# EAGLE design T_LIDAR (EAGLE 9.4.2)
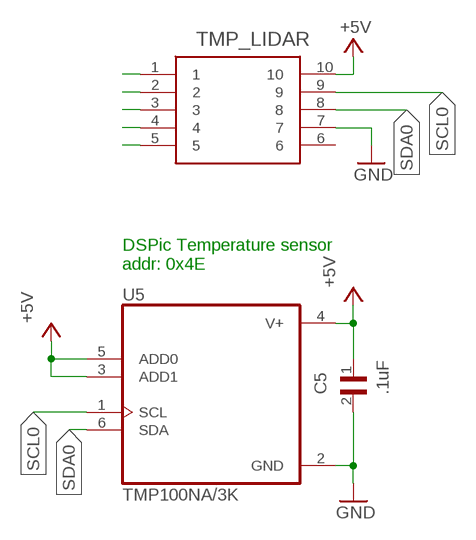
[diagram p0: schematic, sheet 1]

## Parts
C5  .1uF  08056C104JAZ2A  [CAPC2012X140N]
TMP_LIDAR  522071060  [522071060]
U5  TMP100NA/3K  [TMP100NA/3K]

## Nets
+5V [power]: C5.1 TMP_LIDAR.10 U5.3(ADD1) U5.4(V+) U5.5(ADD0)
GND: C5.2 TMP_LIDAR.7 U5.2(GND)
N$1: TMP_LIDAR.1
N$2: TMP_LIDAR.2
N$3: TMP_LIDAR.3
N$4: TMP_LIDAR.4
N$5: TMP_LIDAR.5
SCL0: TMP_LIDAR.9 U5.1(SCL)
SDA0: TMP_LIDAR.8 U5.6(SDA)
Unconnected: TMP_LIDAR.6

## Notes on the sheet
- DSPic Temperature sensor
  addr: 0x4E

## Library data of the parts
C5 = 08056C104JAZ2A:08056C104JAZ2A: Cap Ceramic 0.1uF 6.3V X7R 5% SMD 0805 FlexiTerm 125°C T/R; AVAILABILITY: Unavailable; DESCRIPTION: 0805 100 nF 6.3 V ±5 % Tolerance X7R SMT Multilayer Ceramic Capacitor; MF: AVX; MP: 08056C104JAZ2A; PACKAGE: 0805 AVX; PRICE: None
TMP_LIDAR = 522071060:522071060: SOCKET FPC, SMT, 1MM, 14 WAY; AVAILABILITY: Unavailable; DESCRIPTION: 1.00mm FFC/FPC Connectors HSG ASSY ZIF SMT 14P; MF: Molex; MP: 52207-1485; PACKAGE: None; PRICE: None
U5 = TMP100NA_3K:TMP100NA/3K: Digital Temperature Sensor with I2C Interface; AVAILABILITY: Unavailable; DESCRIPTION: Temperature Sensor with I2C/SMBus Interface in SOT-23 6-SOT-23 -55 to 125; MF: Texas Instruments; MP: TMP100NA/3K; PACKAGE: SOT-23 Texas Instruments; PRICE: None

## Net classes
1 power: width 0.254 mm

## Board
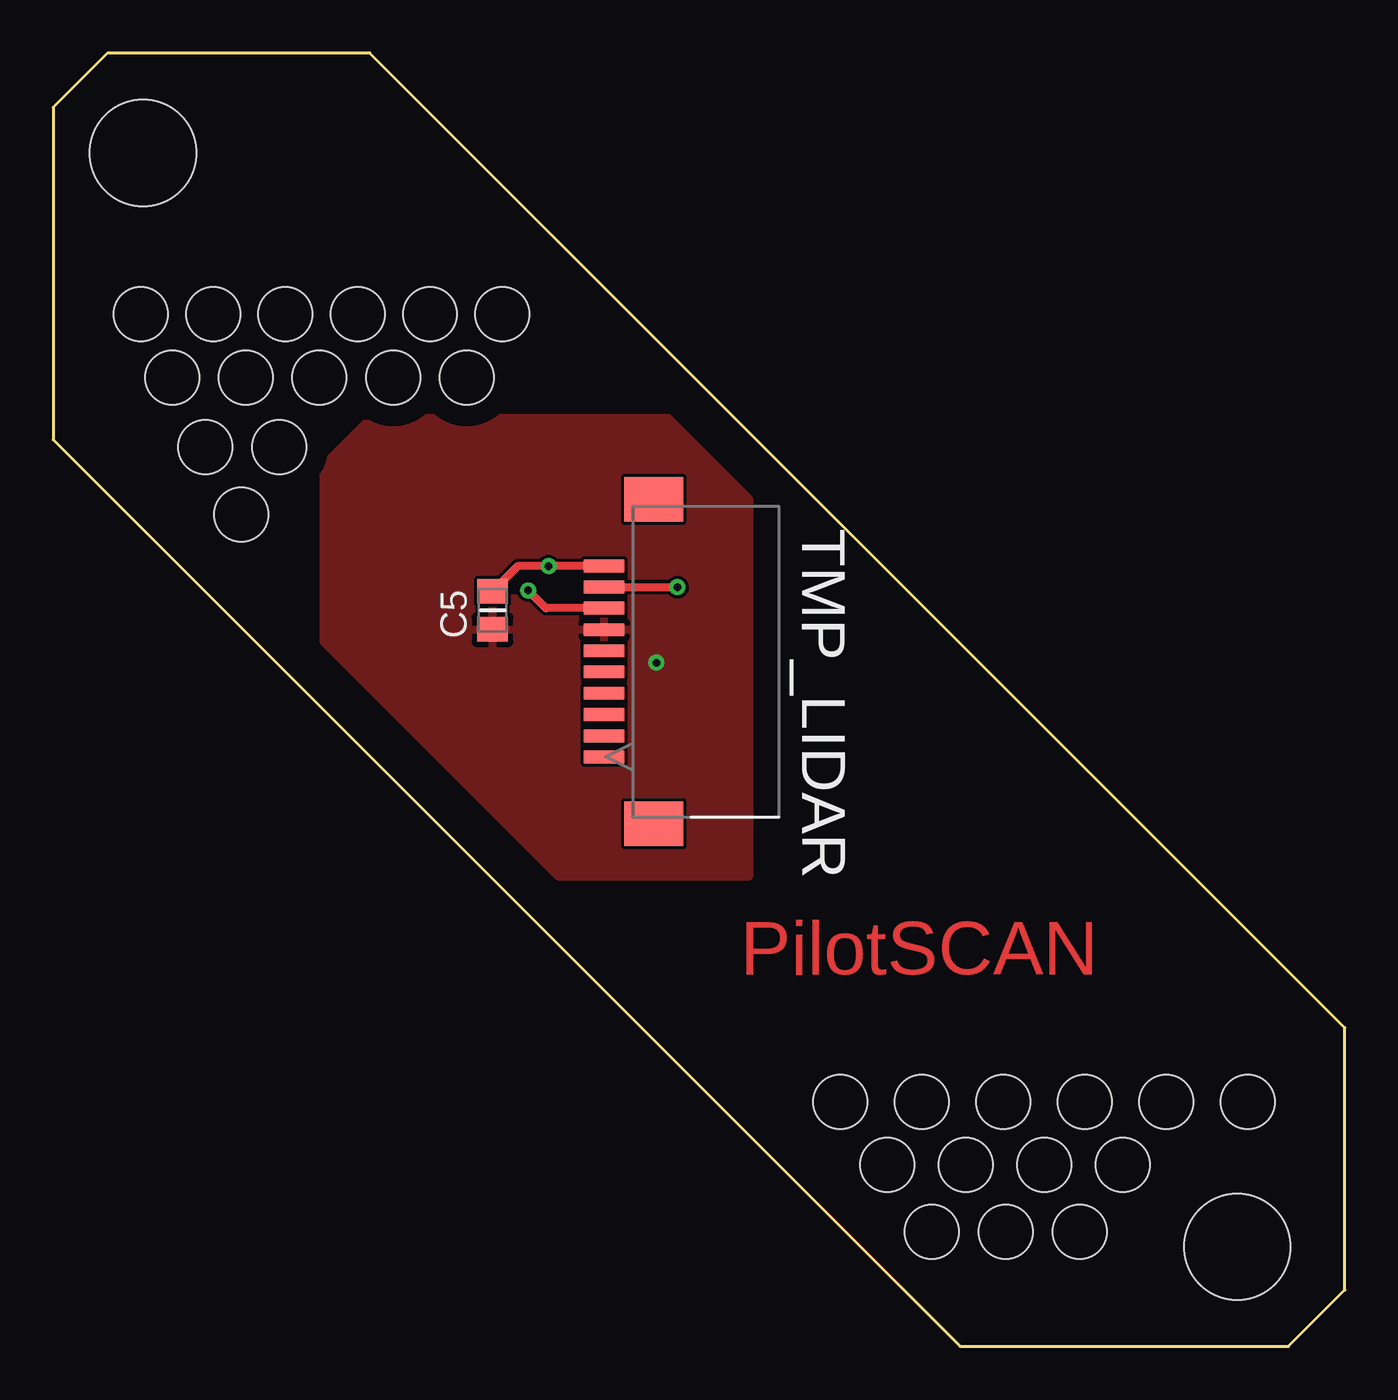
[diagram p1: board, top side]
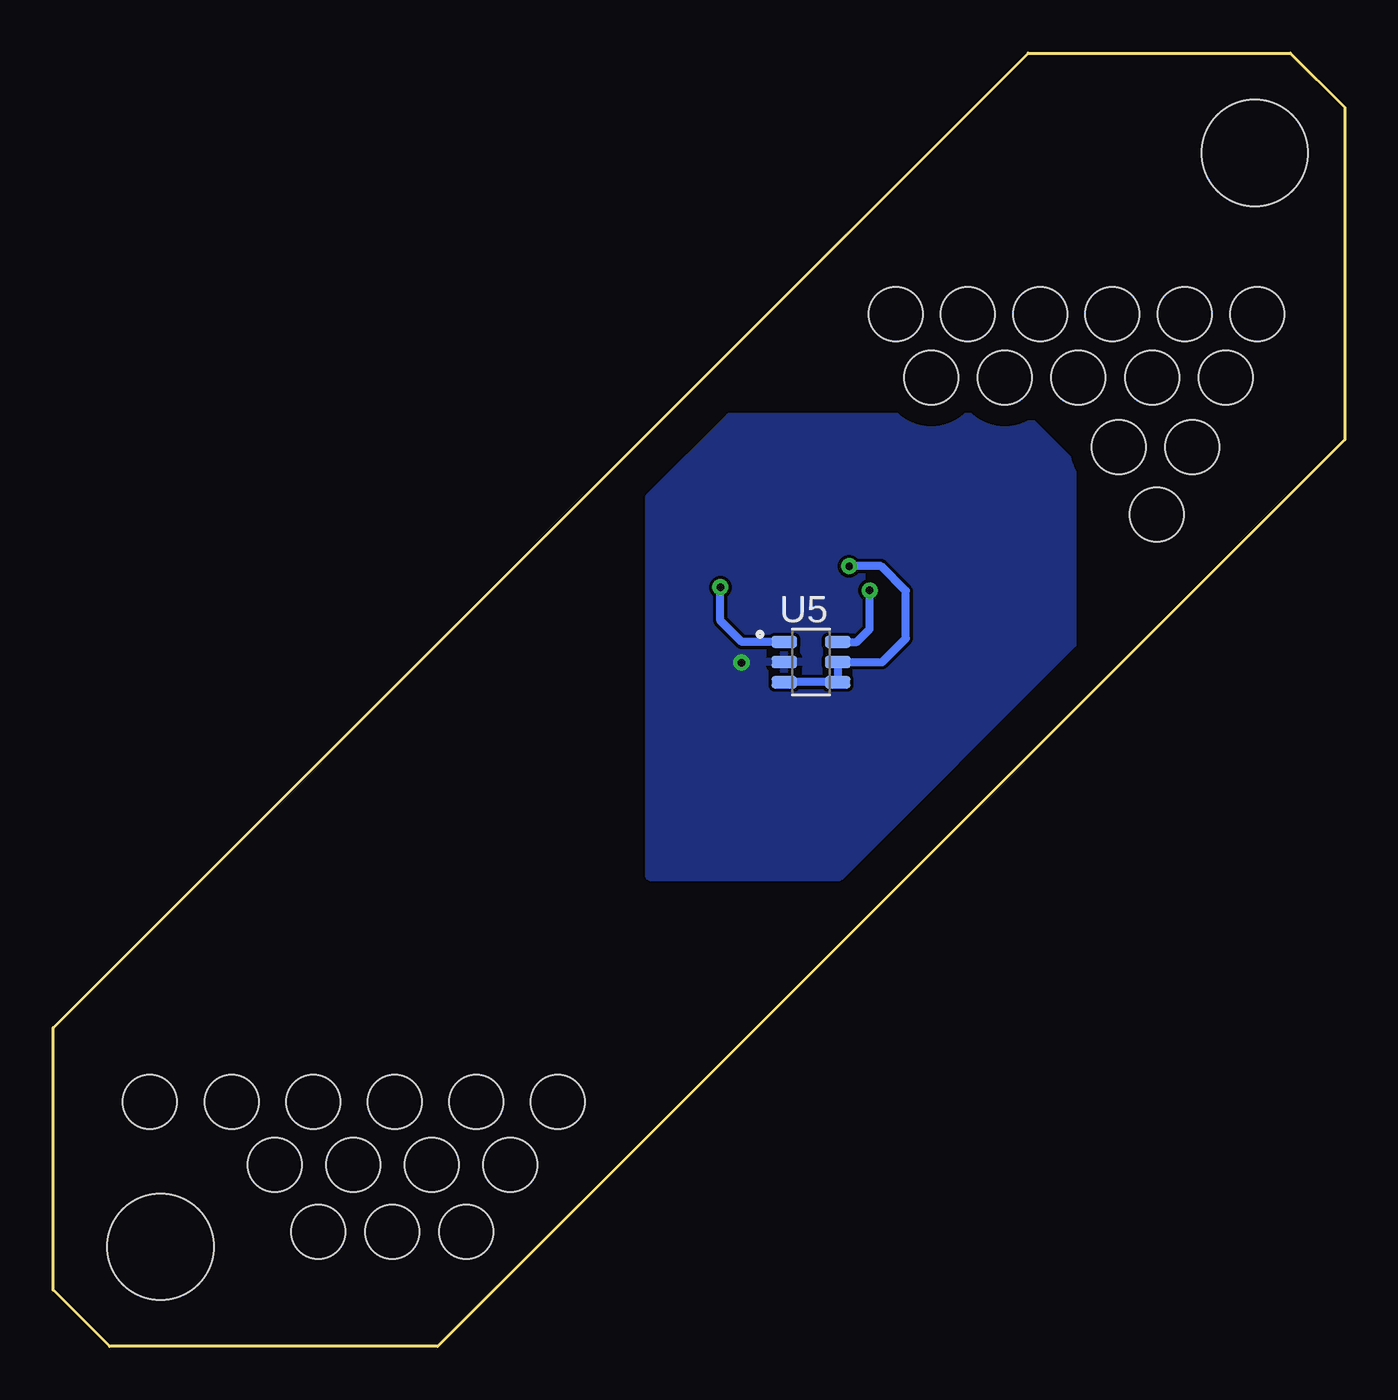
[diagram p2: board, bottom side, seen from below]

Size 60.91 x 61.01 mm. Coordinates in mm from the lower left corner, seen from the top.
Outline: 0,58.45 0,42.77 42.77,0 58.24,0 60.91,2.67 60.91,15.04 14.93,61.01 2.57,61.01 0,58.45
Copper layers (1*16): Top 0.035mm / dielectric 1.5mm / Bottom 0.035mm
Design rules "default": minimum track width 6mil, minimum drill 0.35mm, track to track 6mil, track to pad 6mil, pad to pad 6mil, via to via 6mil, smd to smd 6mil, copper to edge 40mil, drill to drill 6mil, minimum pad ring 10mil, minimum via ring 8mil, stop-mask expansion 4mil, vias tented up to drill 0mil, thermal gap 10mil
Holes 5 mm at 55.84,4.7 4.24,56.3
Holes 2.54 mm at 4.14,48.69 7.55,48.69 10.96,48.69 14.37,48.69 17.77,48.69 21.18,48.69 37.11,11.53 40.95,11.53 44.8,11.53 48.65,11.53 52.49,11.53 56.34,11.53 39.34,8.57 43.04,8.57 46.74,8.57 50.44,8.57 41.43,5.41 44.92,5.41 48.41,5.41 5.61,45.71 9.09,45.71 12.56,45.71 16.03,45.71 19.51,45.71 7.19,42.43 10.67,42.43 8.86,39.23

### Footprints (pad centres in the part's own frame; a part is rotated, then mirrored left to right if it is on the bottom)
CAPC2012X140N = smd 1.15 x 1.45: 1 -0.9,0; 2 0.9,0
522071060 = smd 0.61 x 1.905: 1 6.502,4.801; 2 5.512,4.801; 3 4.496,4.801; 4 3.505,4.801; 5 2.489,4.801; 6 1.499,4.801; 7 0.508,4.801; 8 -0.508,4.801; 9 -1.499,4.801; 10 -2.489,4.801 | smd 2.108 x 2.794: Z1 -5.642,7.137; Z2 9.652,7.137
TMP100NA/3K = smd 1.21 x 0.58: 1 -1.255,0.95; 2 -1.255,0; 3 -1.255,-0.95; 4 1.255,-0.95; 5 1.255,0; 6 1.255,0.95

### Placement (x,y rotation side)
C5  20.73,34.72 270 top
TMP_LIDAR  21.18,34.32 270 top
U5  25.17,32.28 0 bottom

### Tracks (layer width: path | path; a pad name or v marks a point on that pad's centre or on a via)
+5V  (via drill 0.35)
  Top 0.381: TMP_LIDAR.10 v23.37,36.8 21.91,36.8 C5.1
  Bottom 0.381: U5.3 U5.4 U5.5 21.82,32.28 20.7,33.4 20.7,35.64 21.87,36.8 v23.37,36.8
GND  (via drill 0.35)
  other vias: 28.45,32.26
  pour Top: 15.01,43.81 28.98,43.81 32.82,39.98 32.82,22.17 32.79,22.15 23.85,22.15 12.78,33.22 12.78,41.58
  pour Bottom: 15.01,43.84 29.01,43.84 32.82,40.03 32.82,22.2 32.77,22.15 23.83,22.15 12.83,33.15 12.83,41.63 15.01,43.81
SCL0  (via drill 0.35)
  Top 0.381: TMP_LIDAR.9 v29.44,35.81
  Bottom 0.381: U5.1 28.43,33.23 29.44,34.24 v29.44,35.81
SDA0  (via drill 0.35)
  Top 0.381: TMP_LIDAR.8 23.24,34.82 v22.4,35.66
  Bottom 0.381: U5.6 23,33.23 22.4,33.83 v22.4,35.66 22.4,35.69

### Text on the board
Top: PilotSCAN